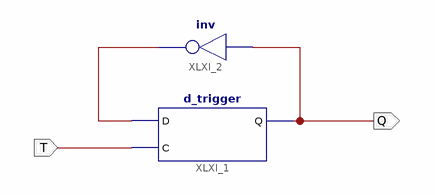
[diagram p0: schematic sheet 1]
// Xilinx ISE schematic t_trigger.sch (spartan6) as structural Verilog: 2 symbols, 2 ports
module t_trigger (
  input  T,
  output Q
);

  wire XLXN_2;

  d_trigger XLXI_1 (.D(XLXN_2), .C(T), .Q(Q));
  not XLXI_2 (XLXN_2, Q);
endmodule
